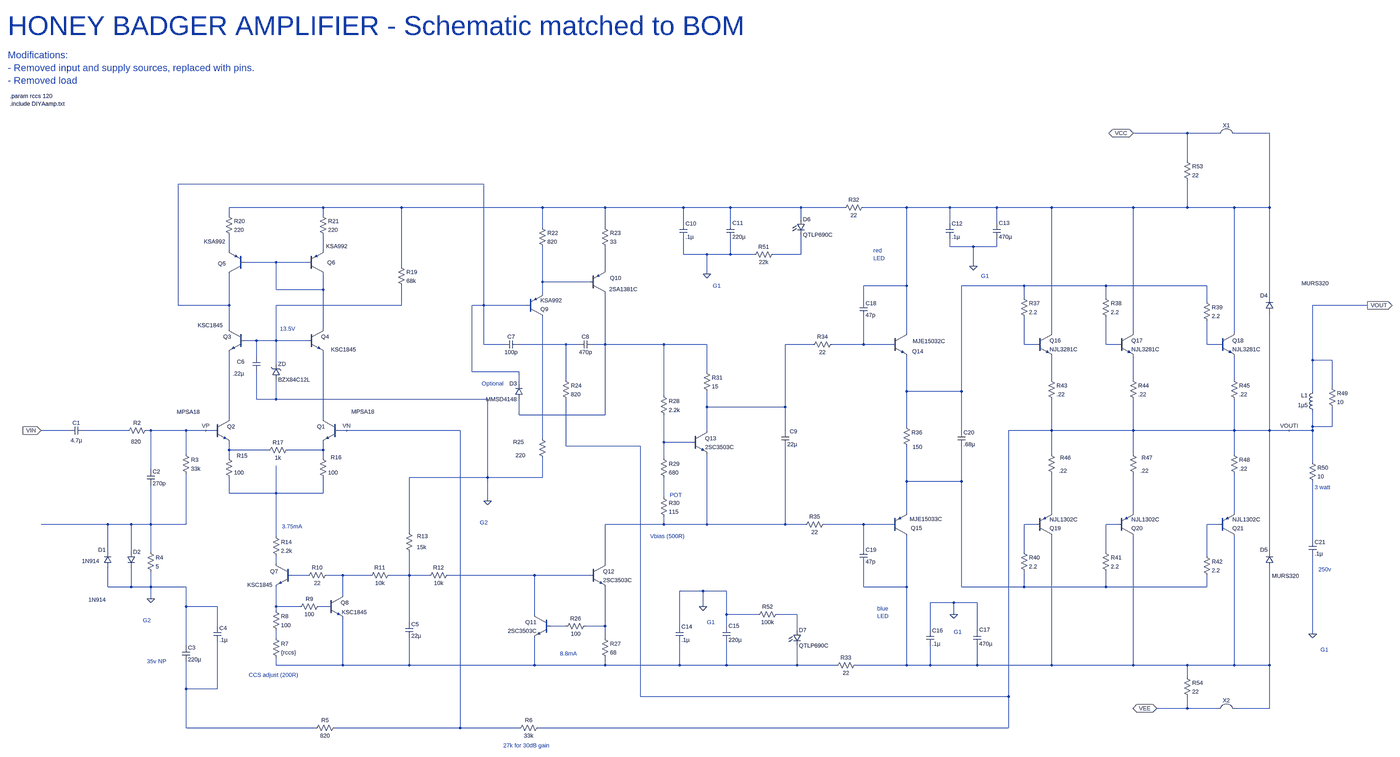
[diagram p0: schematic DIYA-amp-LT-2p4-BOM_SH.asc, whole sheet]
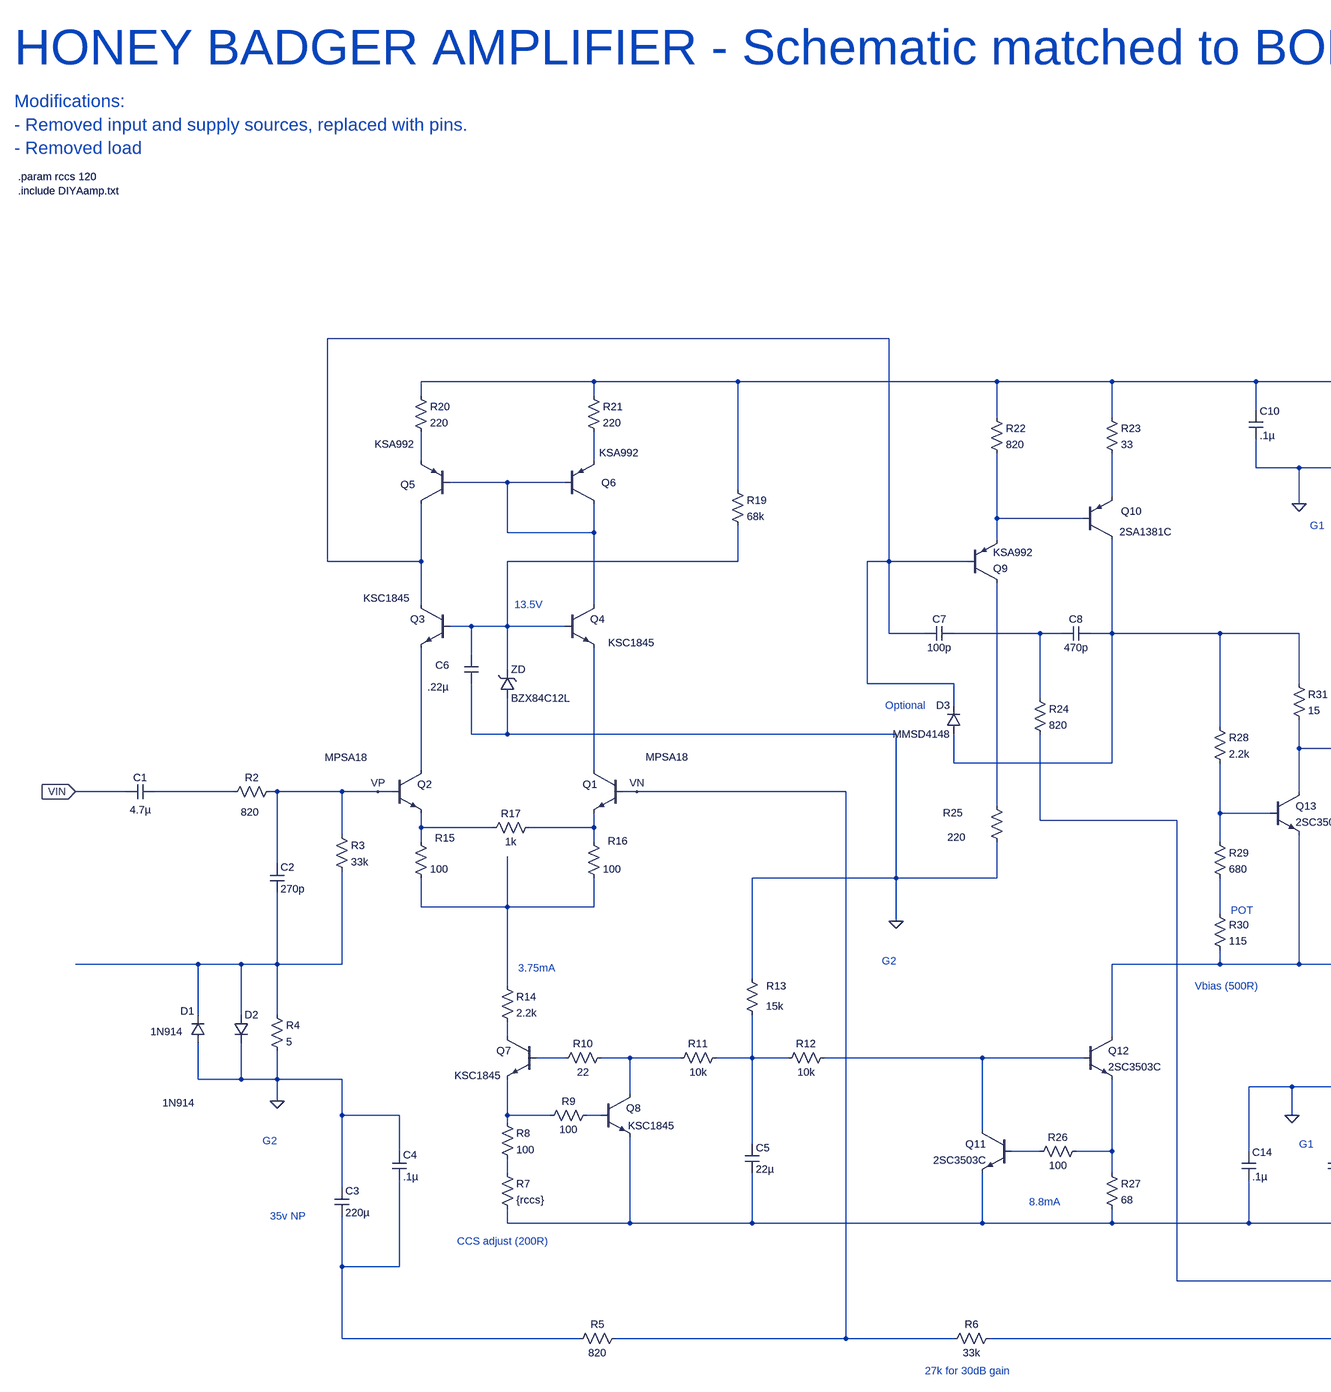
[diagram p1: schematic DIYA-amp-LT-2p4-BOM_SH.asc, part, row 1 of 1, column 1 of 2]
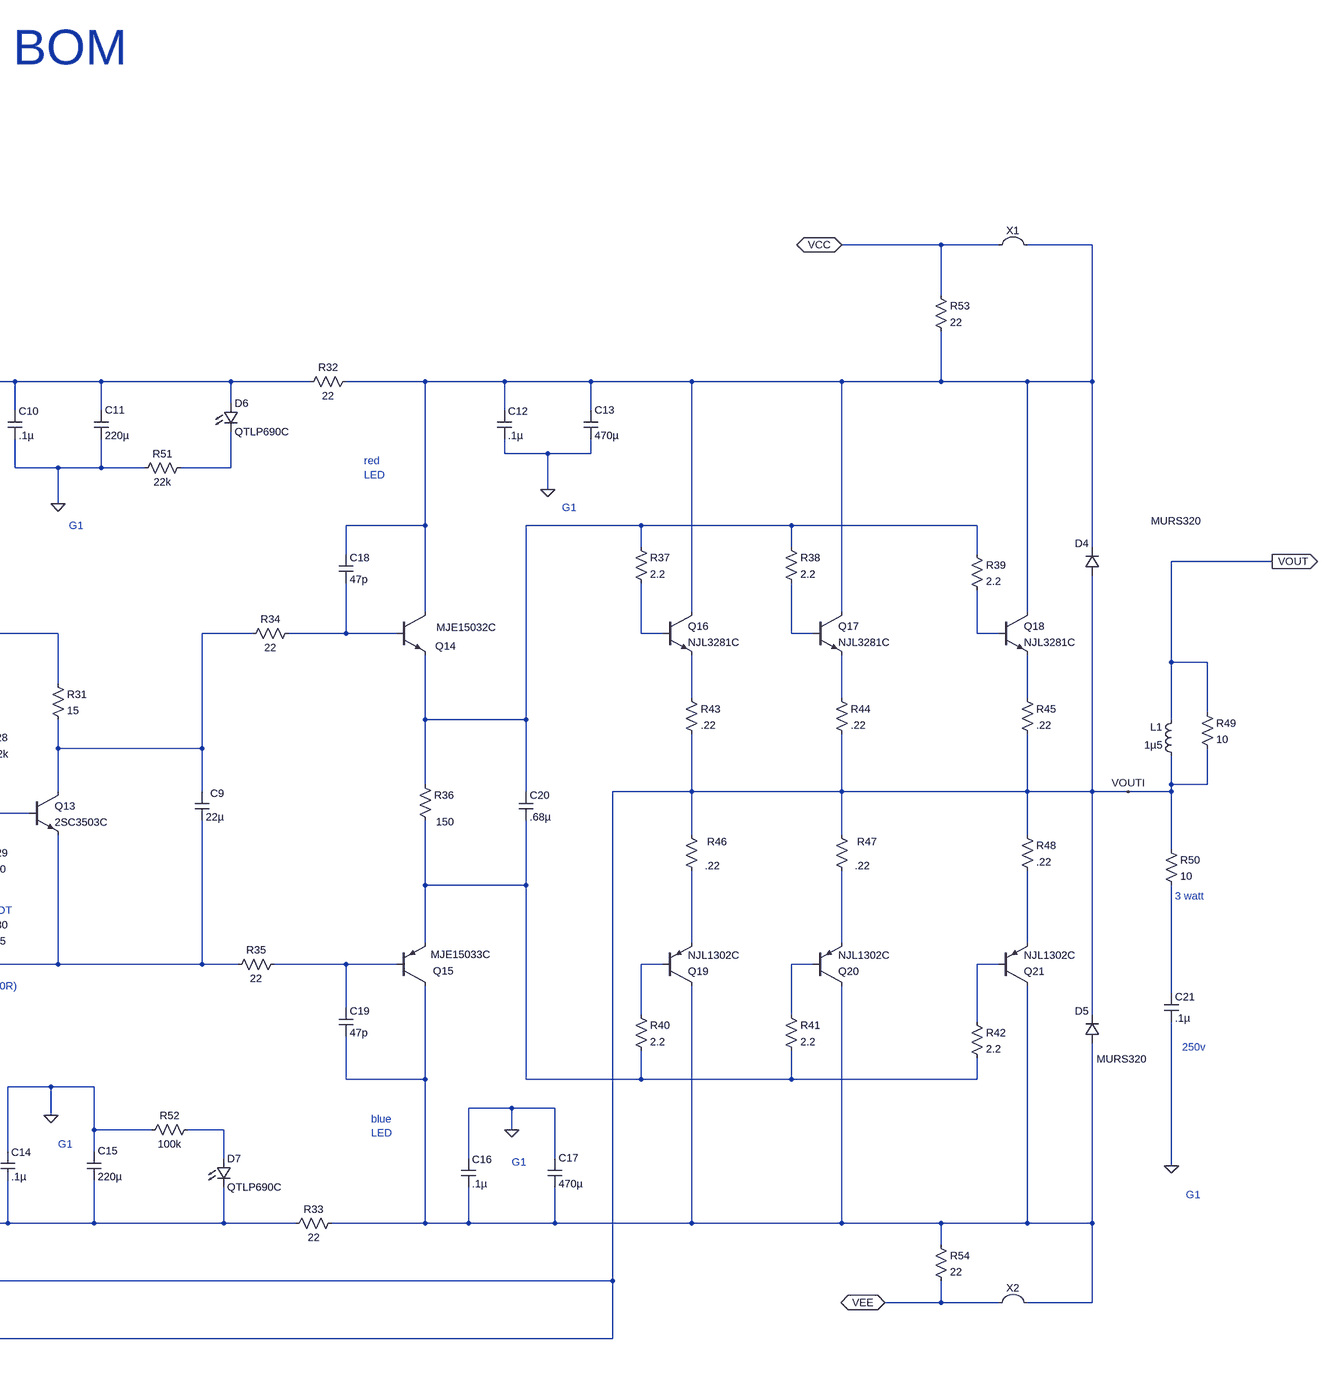
[diagram p2: schematic DIYA-amp-LT-2p4-BOM_SH.asc, part, row 1 of 1, column 2 of 2]
DIYA-amp-LT-2p4-BOM_SH.asc, the LTspice schematic file:
Version 4
SHEET 1 5148 21624
WIRE 3568 -512 3344 -512
WIRE 3696 -512 3568 -512
WIRE 3904 -512 3760 -512
WIRE 3568 -400 3568 -512
WIRE 592 -304 -656 -304
WIRE -64 -208 -448 -208
WIRE 256 -208 -64 -208
WIRE 832 -208 256 -208
WIRE 1088 -208 832 -208
WIRE 1408 -208 1088 -208
WIRE 1600 -208 1408 -208
WIRE 1888 -208 1600 -208
WIRE 2064 -208 1888 -208
WIRE 2320 -208 2144 -208
WIRE 2496 -208 2320 -208
WIRE 2688 -208 2496 -208
WIRE 2912 -208 2688 -208
WIRE 3344 -208 2912 -208
WIRE 3568 -208 3568 -320
WIRE 3568 -208 3344 -208
WIRE 3760 -208 3568 -208
WIRE 3904 -208 3904 -512
WIRE 3904 -208 3760 -208
WIRE -448 -176 -448 -208
WIRE -64 -176 -64 -208
WIRE 1888 -160 1888 -208
WIRE 1408 -144 1408 -208
WIRE 1600 -144 1600 -208
WIRE 2496 -144 2496 -208
WIRE 2688 -144 2688 -208
WIRE 832 -128 832 -208
WIRE 1088 -128 1088 -208
WIRE 2496 -48 2496 -80
WIRE 2592 -48 2496 -48
WIRE 2688 -48 2688 -80
WIRE 2688 -48 2592 -48
WIRE -448 -32 -448 -96
WIRE -64 -32 -64 -96
WIRE 1408 -16 1408 -80
WIRE 1504 -16 1408 -16
WIRE 1600 -16 1600 -80
WIRE 1600 -16 1504 -16
WIRE 1696 -16 1600 -16
WIRE 1888 -16 1888 -96
WIRE 1888 -16 1776 -16
WIRE -256 16 -384 16
WIRE -128 16 -256 16
WIRE 256 32 256 -208
WIRE 2592 32 2592 -48
WIRE 1088 48 1088 -48
WIRE 1504 64 1504 -16
WIRE 832 96 832 -48
WIRE 1024 96 832 96
WIRE 2320 112 2320 -208
WIRE 2320 112 2144 112
WIRE 2800 112 2544 112
WIRE 3232 112 2800 112
WIRE 3648 112 3232 112
WIRE -256 128 -256 16
WIRE -64 128 -64 64
WIRE -64 128 -256 128
WIRE 832 144 832 96
WIRE 2800 160 2800 112
WIRE 3232 160 3232 112
WIRE 3904 160 3904 -208
WIRE 2144 176 2144 112
WIRE 3648 176 3648 112
WIRE -656 192 -656 -304
WIRE -448 192 -448 64
WIRE -448 192 -656 192
WIRE 256 192 256 112
WIRE 256 192 -256 192
WIRE 592 192 592 -304
WIRE 592 192 544 192
WIRE 768 192 592 192
WIRE 4304 192 4080 192
WIRE -448 288 -448 192
WIRE -64 288 -64 128
WIRE 2320 304 2320 112
WIRE 2912 304 2912 -208
WIRE 3344 304 3344 -208
WIRE 3760 304 3760 -208
WIRE -336 336 -384 336
WIRE -256 336 -256 192
WIRE -256 336 -336 336
WIRE -128 336 -256 336
WIRE 592 352 592 192
WIRE 672 352 592 352
WIRE 928 352 736 352
WIRE 976 352 928 352
WIRE 1088 352 1088 144
WIRE 1088 352 1040 352
WIRE 1328 352 1088 352
WIRE 1504 352 1328 352
WIRE 1936 352 1824 352
WIRE 2144 352 2144 240
WIRE 2144 352 2016 352
WIRE 2256 352 2144 352
WIRE 2800 352 2800 240
WIRE 2848 352 2800 352
WIRE 3232 352 3232 240
WIRE 3280 352 3232 352
WIRE 3648 352 3648 256
WIRE 3696 352 3648 352
WIRE -336 400 -336 336
WIRE 4080 416 4080 192
WIRE 4160 416 4080 416
WIRE -256 432 -256 336
WIRE 544 464 544 192
WIRE 736 464 544 464
WIRE 1504 464 1504 352
WIRE 928 496 928 352
WIRE 2912 496 2912 400
WIRE 3344 496 3344 400
WIRE 3760 496 3760 400
WIRE 736 512 736 464
WIRE 4160 528 4160 416
WIRE 2320 544 2320 400
WIRE 2544 544 2544 112
WIRE 2544 544 2320 544
WIRE 4080 544 4080 416
WIRE 1328 560 1328 352
WIRE -336 576 -336 464
WIRE -256 576 -256 496
WIRE -256 576 -336 576
WIRE 608 576 -256 576
WIRE 1504 608 1504 544
WIRE 1824 608 1824 352
WIRE 1824 608 1504 608
WIRE 736 640 736 576
WIRE 1088 640 1088 352
WIRE 1088 640 736 640
WIRE -448 656 -448 384
WIRE -64 656 -64 384
WIRE 2320 688 2320 544
WIRE 4080 688 4080 624
WIRE 4160 688 4160 608
WIRE 4160 688 4080 688
WIRE -1104 704 -1216 704
WIRE -864 704 -1040 704
WIRE -768 704 -784 704
WIRE -624 704 -768 704
WIRE -544 704 -624 704
WIRE -512 704 -544 704
WIRE 32 704 0 704
WIRE 496 704 32 704
WIRE 1504 704 1504 608
WIRE 1824 704 1824 608
WIRE 2544 704 2544 544
WIRE 2912 704 2912 576
WIRE 2912 704 2736 704
WIRE 3344 704 3344 576
WIRE 3344 704 2912 704
WIRE 3760 704 3760 576
WIRE 3760 704 3344 704
WIRE 3904 704 3904 224
WIRE 3904 704 3760 704
WIRE 3984 704 3904 704
WIRE 4080 704 4080 688
WIRE 4080 704 3984 704
WIRE 832 736 832 240
WIRE 1328 752 1328 640
WIRE 1440 752 1328 752
WIRE 928 768 928 576
WIRE 1232 768 928 768
WIRE -448 784 -448 752
WIRE -288 784 -448 784
WIRE -64 784 -64 752
WIRE -64 784 -208 784
WIRE -624 800 -624 704
WIRE 2912 800 2912 704
WIRE 3344 800 3344 704
WIRE 3760 800 3760 704
WIRE -448 816 -448 784
WIRE -64 816 -64 784
WIRE 1328 816 1328 752
WIRE 4080 832 4080 704
WIRE -768 864 -768 704
WIRE 608 896 608 576
WIRE 608 896 288 896
WIRE 832 896 832 816
WIRE 832 896 608 896
WIRE 2320 912 2320 768
WIRE 2544 912 2544 768
WIRE 2544 912 2320 912
WIRE -448 960 -448 896
WIRE -256 960 -256 848
WIRE -256 960 -448 960
WIRE -64 960 -64 896
WIRE -64 960 -256 960
WIRE 1328 976 1328 896
WIRE 608 992 608 896
WIRE 2320 1040 2320 912
WIRE 2912 1040 2912 880
WIRE 3344 1040 3344 880
WIRE 3760 1040 3760 880
WIRE -944 1088 -1216 1088
WIRE -848 1088 -944 1088
WIRE -768 1088 -768 928
WIRE -768 1088 -848 1088
WIRE -624 1088 -624 880
WIRE -624 1088 -768 1088
WIRE 1328 1088 1328 1056
WIRE 1328 1088 1088 1088
WIRE 1504 1088 1504 800
WIRE 1504 1088 1328 1088
WIRE 1824 1088 1824 768
WIRE 1824 1088 1504 1088
WIRE 1904 1088 1824 1088
WIRE 2144 1088 1984 1088
WIRE 2256 1088 2144 1088
WIRE 2848 1088 2800 1088
WIRE 3280 1088 3232 1088
WIRE 3696 1088 3648 1088
WIRE 288 1120 288 896
WIRE -256 1136 -256 960
WIRE 4080 1152 4080 912
WIRE 2144 1184 2144 1088
WIRE -944 1200 -944 1088
WIRE -848 1200 -848 1088
WIRE -768 1200 -768 1088
WIRE 2800 1200 2800 1088
WIRE 3232 1200 3232 1088
WIRE 3904 1200 3904 704
WIRE 3648 1216 3648 1088
WIRE -256 1248 -256 1216
WIRE 1088 1248 1088 1088
WIRE -128 1296 -192 1296
WIRE 16 1296 -48 1296
WIRE 128 1296 16 1296
WIRE 288 1296 288 1200
WIRE 288 1296 208 1296
WIRE 368 1296 288 1296
WIRE 800 1296 448 1296
WIRE 1024 1296 800 1296
WIRE -944 1344 -944 1264
WIRE -848 1344 -848 1264
WIRE -848 1344 -944 1344
WIRE -768 1344 -768 1280
WIRE -768 1344 -848 1344
WIRE -624 1344 -768 1344
WIRE 2144 1344 2144 1248
WIRE 2320 1344 2320 1136
WIRE 2320 1344 2144 1344
WIRE 2544 1344 2544 912
WIRE 2800 1344 2800 1280
WIRE 2800 1344 2544 1344
WIRE 3232 1344 3232 1280
WIRE 3232 1344 2800 1344
WIRE 3648 1344 3648 1296
WIRE 3648 1344 3232 1344
WIRE 1488 1360 1392 1360
WIRE 1584 1360 1488 1360
WIRE 16 1376 16 1296
WIRE -768 1392 -768 1344
WIRE 2512 1408 2416 1408
WIRE 2608 1408 2512 1408
WIRE -624 1424 -624 1344
WIRE -496 1424 -624 1424
WIRE -256 1424 -256 1344
WIRE -160 1424 -256 1424
WIRE -48 1424 -80 1424
WIRE 1488 1424 1488 1360
WIRE -256 1440 -256 1424
WIRE 800 1456 800 1296
WIRE 1584 1456 1584 1360
WIRE 1712 1456 1584 1456
WIRE 1872 1456 1792 1456
WIRE 2512 1456 2512 1408
WIRE 288 1488 288 1296
WIRE -496 1504 -496 1424
WIRE 928 1504 864 1504
WIRE 1088 1504 1088 1344
WIRE 1088 1504 1008 1504
WIRE 1392 1504 1392 1360
WIRE 1584 1504 1584 1456
WIRE 1872 1520 1872 1456
WIRE 2416 1520 2416 1408
WIRE 2608 1520 2608 1408
WIRE 4080 1536 4080 1216
WIRE -256 1552 -256 1520
WIRE 1088 1552 1088 1504
WIRE -624 1584 -624 1424
WIRE -256 1664 -256 1632
WIRE 16 1664 16 1472
WIRE 16 1664 -256 1664
WIRE 288 1664 288 1552
WIRE 288 1664 16 1664
WIRE 800 1664 800 1552
WIRE 800 1664 288 1664
WIRE 1088 1664 1088 1632
WIRE 1088 1664 800 1664
WIRE 1392 1664 1392 1568
WIRE 1392 1664 1088 1664
WIRE 1584 1664 1584 1568
WIRE 1584 1664 1392 1664
WIRE 1872 1664 1872 1584
WIRE 1872 1664 1584 1664
WIRE 2032 1664 1872 1664
WIRE 2320 1664 2320 1344
WIRE 2320 1664 2112 1664
WIRE 2416 1664 2416 1584
WIRE 2416 1664 2320 1664
WIRE 2608 1664 2608 1584
WIRE 2608 1664 2416 1664
WIRE 2912 1664 2912 1136
WIRE 2912 1664 2608 1664
WIRE 3344 1664 3344 1136
WIRE 3344 1664 2912 1664
WIRE 3568 1664 3344 1664
WIRE 3760 1664 3760 1136
WIRE 3760 1664 3568 1664
WIRE 3904 1664 3904 1264
WIRE 3904 1664 3760 1664
WIRE 3568 1712 3568 1664
WIRE -624 1760 -624 1648
WIRE -496 1760 -496 1568
WIRE -496 1760 -624 1760
WIRE 1232 1792 1232 768
WIRE 2736 1792 2736 704
WIRE 2736 1792 1232 1792
WIRE 3568 1840 3568 1792
WIRE 3568 1840 3440 1840
WIRE 3696 1840 3568 1840
WIRE 3904 1840 3904 1664
WIRE 3904 1840 3760 1840
WIRE -624 1920 -624 1760
WIRE -96 1920 -624 1920
WIRE 496 1920 496 704
WIRE 496 1920 -16 1920
WIRE 736 1920 496 1920
WIRE 2736 1920 2736 1792
WIRE 2736 1920 816 1920
FLAG -768 1392 0
FLAG 2592 32 0
FLAG 4080 1536 0
FLAG 608 992 0
FLAG 2512 1456 0
FLAG 1504 64 0
FLAG 1488 1424 0
FLAG -1216 704 VIN
IOPIN -1216 704 In
FLAG 3344 -512 VCC
IOPIN 3344 -512 BiDir
FLAG 3440 1840 VEE
IOPIN 3440 1840 BiDir
FLAG 4304 192 VOUT
IOPIN 4304 192 Out
FLAG -544 704 VP
FLAG 32 704 VN
FLAG 3984 704 VOUTI
SYMBOL res -80 -192 R0
SYMATTR InstName R21
SYMATTR Value 220
SYMBOL res -464 -192 R0
SYMATTR InstName R20
SYMATTR Value 220
SYMBOL res -80 800 R0
WINDOW 0 47 14 Left 2
SYMATTR InstName R16
SYMATTR Value 100
SYMBOL res -464 800 R0
WINDOW 0 47 7 Left 2
SYMATTR InstName R15
SYMATTR Value 100
SYMBOL res -272 1120 R0
SYMATTR InstName R14
SYMATTR Value 2.2k
SYMBOL res -272 1536 R0
SYMATTR InstName R7
SYMATTR Value {rccs}
SYMBOL res -640 784 R0
SYMATTR InstName R3
SYMATTR Value 33k
SYMBOL res -768 688 R90
WINDOW 0 0 56 VBottom 2
WINDOW 3 46 60 VTop 2
SYMATTR InstName R2
SYMATTR Value 820
SYMBOL pnp 1024 144 M180
WINDOW 3 81 18 Left 2
WINDOW 0 84 64 Left 2
SYMATTR Value 2SA1381C
SYMATTR InstName Q10
SYMBOL npn 1024 1248 R0
SYMATTR InstName Q12
SYMATTR Value 2SC3503C
SYMBOL npn 2256 304 R0
WINDOW 0 86 76 Left 2
WINDOW 3 89 35 Left 2
SYMATTR InstName Q14
SYMATTR Value MJE15032C
SYMBOL res 3744 480 R0
SYMATTR InstName R45
SYMATTR Value .22
SYMBOL res 3744 784 R0
SYMATTR InstName R48
SYMATTR Value .22
SYMBOL res 4064 816 R0
SYMATTR InstName R50
SYMATTR Value 10
SYMBOL pnp 2256 1136 M180
WINDOW 0 81 33 Left 2
WINDOW 3 76 70 Left 2
SYMATTR InstName Q15
SYMATTR Value MJE15033C
SYMBOL res -784 1184 R0
SYMATTR InstName R4
SYMATTR Value 5
SYMBOL npn -192 1248 M0
WINDOW 3 79 87 Left 2
SYMATTR Value KSC1845
SYMATTR InstName Q7
SYMBOL npn -48 1376 R0
WINDOW 3 60 71 Left 2
SYMATTR Value KSC1845
SYMATTR InstName Q8
SYMBOL res 3632 160 R0
SYMATTR InstName R39
SYMATTR Value 2.2
SYMBOL res 3632 1200 R0
SYMATTR InstName R42
SYMATTR Value 2.2
SYMBOL ind 4096 640 R180
WINDOW 0 36 80 Left 2
WINDOW 3 36 40 Left 2
SYMATTR InstName L1
SYMATTR Value 1µ5
SYMBOL diode -864 1200 R0
WINDOW 3 -159 196 Left 2
SYMATTR Value 1N914
SYMATTR InstName D2
SYMBOL diode -928 1264 R180
WINDOW 0 24 72 Left 2
WINDOW 3 50 26 Left 2
SYMATTR InstName D1
SYMATTR Value 1N914
SYMBOL cap 4064 1152 R0
SYMATTR InstName C21
SYMATTR Value .1µ
SYMBOL res 4144 512 R0
SYMATTR InstName R49
SYMATTR Value 10
SYMBOL res 272 1104 R0
WINDOW 0 48 32 Left 2
WINDOW 3 47 77 Left 2
SYMATTR InstName R13
SYMATTR Value 15k
SYMBOL res -272 1424 R0
SYMATTR InstName R8
SYMATTR Value 100
SYMBOL cap -784 864 R0
SYMATTR InstName C2
SYMATTR Value 270p
SYMBOL res 832 1904 R90
WINDOW 3 32 56 VTop 2
WINDOW 0 0 56 VBottom 2
SYMATTR Value 33k
SYMATTR InstName R6
SYMBOL cap -640 1584 R0
SYMATTR InstName C3
SYMATTR Value 220µ
SYMBOL cap -1040 688 R90
WINDOW 0 0 32 VBottom 2
WINDOW 3 41 32 VTop 2
SYMATTR InstName C1
SYMATTR Value 4.7µ
SYMBOL cap -512 1504 R0
SYMATTR InstName C4
SYMATTR Value .1µ
SYMBOL pnp -384 64 R180
WINDOW 0 77 43 Left 2
WINDOW 3 79 133 Left 2
SYMATTR InstName Q5
SYMATTR Value KSA992
SYMBOL pnp -128 64 M180
WINDOW 0 81 47 Left 2
WINDOW 3 76 114 Left 2
SYMATTR InstName Q6
SYMATTR Value KSA992
SYMBOL res 1072 -144 R0
SYMATTR InstName R23
SYMATTR Value 33
SYMBOL npn 864 1456 M0
SYMATTR InstName Q11
SYMATTR Value 2SC3503C
SYMBOL pnp 768 240 M180
SYMATTR InstName Q9
SYMATTR Value KSA992
SYMBOL res 816 -144 R0
SYMATTR InstName R22
SYMATTR Value 820
SYMBOL res 1072 1536 R0
SYMATTR InstName R27
SYMATTR Value 68
SYMBOL res 816 720 R0
WINDOW 0 -104 31 Left 2
WINDOW 3 -94 85 Left 2
SYMATTR InstName R25
SYMATTR Value 220
SYMBOL res 224 1280 R90
WINDOW 0 0 56 VBottom 2
WINDOW 3 32 56 VTop 2
SYMATTR InstName R11
SYMATTR Value 10k
SYMBOL cap 272 1488 R0
SYMATTR InstName C5
SYMATTR Value 22µ
SYMBOL npn 3696 304 R0
SYMATTR InstName Q18
SYMATTR Value NJL3281C
SYMBOL pnp 3696 1136 M180
SYMATTR InstName Q21
SYMATTR Value NJL1302C
SYMBOL res 2896 480 R0
SYMATTR InstName R43
SYMATTR Value .22
SYMBOL res 2896 784 R0
WINDOW 0 50 31 Left 2
WINDOW 3 45 85 Left 2
SYMATTR InstName R46
SYMATTR Value .22
SYMBOL res 2784 144 R0
SYMATTR InstName R37
SYMATTR Value 2.2
SYMBOL res 2784 1184 R0
SYMATTR InstName R40
SYMATTR Value 2.2
SYMBOL npn 2848 304 R0
SYMATTR InstName Q16
SYMATTR Value NJL3281C
SYMBOL pnp 2848 1136 M180
SYMATTR InstName Q19
SYMATTR Value NJL1302C
SYMBOL res 464 1280 R90
WINDOW 0 0 56 VBottom 2
WINDOW 3 32 56 VTop 2
SYMATTR InstName R12
SYMATTR Value 10k
SYMBOL res -192 768 R90
WINDOW 0 0 56 VBottom 2
WINDOW 3 32 56 VTop 2
SYMATTR InstName R17
SYMATTR Value 1k
SYMBOL npn 1440 704 R0
SYMATTR InstName Q13
SYMATTR Value 2SC3503C
SYMBOL res 1312 960 R0
SYMATTR InstName R30
SYMATTR Value 115
SYMBOL res 1312 800 R0
SYMATTR InstName R29
SYMATTR Value 680
SYMBOL res 1312 544 R0
SYMATTR InstName R28
SYMATTR Value 2.2k
SYMBOL cap 1808 704 R0
WINDOW 0 34 4 Left 2
SYMATTR InstName C9
SYMATTR Value 22µ
SYMBOL diode 3920 224 R180
WINDOW 0 24 72 Left 2
WINDOW 3 -226 122 Left 2
SYMATTR InstName D4
SYMATTR Value MURS320
SYMBOL diode 3920 1264 R180
WINDOW 0 24 72 Left 2
WINDOW 3 -105 -35 Left 2
SYMATTR InstName D5
SYMATTR Value MURS320
SYMBOL cap 2480 -144 R0
WINDOW 0 24 2 Left 2
SYMATTR InstName C12
SYMATTR Value .1µ
SYMBOL cap 2672 -144 R0
WINDOW 0 24 -1 Left 2
SYMATTR InstName C13
SYMATTR Value 470µ
SYMBOL res 2304 672 R0
WINDOW 3 40 99 Left 2
SYMATTR Value 150
SYMATTR InstName R36
SYMBOL res 1024 1488 R90
WINDOW 0 0 56 VBottom 2
WINDOW 3 32 56 VTop 2
SYMATTR InstName R26
SYMATTR Value 100
SYMBOL cap 2528 704 R0
SYMATTR InstName C20
SYMATTR Value .68µ
SYMBOL cap 672 368 R270
WINDOW 0 32 32 VTop 2
WINDOW 3 0 32 VBottom 2
SYMATTR InstName C7
SYMATTR Value 100p
SYMBOL res -64 1408 R90
WINDOW 0 0 56 VBottom 2
WINDOW 3 32 56 VTop 2
SYMATTR InstName R9
SYMATTR Value 100
SYMBOL cap 2400 1520 R0
WINDOW 0 24 2 Left 2
SYMATTR InstName C16
SYMATTR Value .1µ
SYMBOL cap 2592 1520 R0
WINDOW 0 24 -1 Left 2
SYMATTR InstName C17
SYMATTR Value 470µ
SYMBOL res 2160 -224 R90
WINDOW 0 0 56 VBottom 2
WINDOW 3 32 56 VTop 2
SYMATTR InstName R32
SYMATTR Value 22
SYMBOL res 2128 1648 R90
WINDOW 0 0 56 VBottom 2
WINDOW 3 32 56 VTop 2
SYMATTR InstName R33
SYMATTR Value 22
SYMBOL cap 1392 -144 R0
WINDOW 0 24 2 Left 2
SYMATTR InstName C10
SYMATTR Value .1µ
SYMBOL cap 1584 -144 R0
WINDOW 0 24 -1 Left 2
SYMATTR InstName C11
SYMATTR Value 220µ
SYMBOL cap 1376 1504 R0
WINDOW 0 24 2 Left 2
SYMATTR InstName C14
SYMATTR Value .1µ
SYMBOL cap 1568 1504 R0
WINDOW 0 24 -1 Left 2
SYMATTR InstName C15
SYMATTR Value 220µ
SYMBOL res 1488 448 R0
SYMATTR InstName R31
SYMATTR Value 15
SYMBOL npn -128 288 R0
WINDOW 3 96 85 Left 2
SYMATTR Value KSC1845
SYMATTR InstName Q4
SYMBOL npn -384 288 M0
WINDOW 3 89 -14 Left 2
SYMATTR Value KSC1845
SYMATTR InstName Q3
SYMBOL res 240 16 R0
SYMATTR InstName R19
SYMATTR Value 68k
SYMBOL cap -352 400 R0
WINDOW 0 -64 23 Left 2
WINDOW 3 -82 71 Left 2
SYMATTR InstName C6
SYMATTR Value .22µ
SYMBOL npn 0 656 M0
WINDOW 3 -146 -29 Left 2
SYMATTR Value MPSA18
SYMATTR InstName Q1
SYMBOL npn -512 656 R0
WINDOW 3 -150 -28 Left 2
SYMATTR Value MPSA18
SYMATTR InstName Q2
SYMBOL res 2032 336 R90
WINDOW 0 0 56 VBottom 2
WINDOW 3 32 56 VTop 2
SYMATTR InstName R34
SYMATTR Value 22
SYMBOL res 2000 1072 R90
WINDOW 0 0 56 VBottom 2
WINDOW 3 32 56 VTop 2
SYMATTR InstName R35
SYMATTR Value 22
SYMBOL res -32 1280 R90
WINDOW 0 0 56 VBottom 2
WINDOW 3 32 56 VTop 2
SYMATTR InstName R10
SYMATTR Value 22
SYMBOL LED 1872 -160 R0
SYMATTR InstName D6
SYMATTR Value QTLP690C
SYMATTR Description Diode
SYMATTR Type diode
SYMBOL res 1792 -32 R90
WINDOW 0 0 56 VBottom 2
WINDOW 3 32 56 VTop 2
SYMATTR InstName R51
SYMATTR Value 22k
SYMBOL res 1808 1440 R90
WINDOW 0 0 56 VBottom 2
WINDOW 3 32 56 VTop 2
SYMATTR InstName R52
SYMATTR Value 100k
SYMBOL LED 1856 1520 R0
SYMATTR InstName D7
SYMATTR Value QTLP690C
SYMATTR Description Diode
SYMATTR Type diode
SYMBOL res 3328 480 R0
SYMATTR InstName R44
SYMATTR Value .22
SYMBOL res 3328 784 R0
WINDOW 0 50 31 Left 2
WINDOW 3 45 85 Left 2
SYMATTR InstName R47
SYMATTR Value .22
SYMBOL res 3216 144 R0
SYMATTR InstName R38
SYMATTR Value 2.2
SYMBOL res 3216 1184 R0
SYMATTR InstName R41
SYMATTR Value 2.2
SYMBOL npn 3280 304 R0
SYMATTR InstName Q17
SYMATTR Value NJL3281C
SYMBOL pnp 3280 1136 M180
SYMATTR InstName Q20
SYMATTR Value NJL1302C
SYMBOL Misc\\jumper 3728 -576 R0
SYMATTR InstName X1
SYMBOL Misc\\jumper 3728 1776 R0
SYMATTR InstName X2
SYMBOL res 3552 -416 R0
SYMATTR InstName R53
SYMATTR Value 22
SYMBOL res 3552 1696 R0
SYMATTR InstName R54
SYMATTR Value 22
SYMBOL zener -272 496 M180
WINDOW 0 24 64 Left 2
WINDOW 3 24 0 Left 2
SYMATTR InstName ZD
SYMATTR Value BZX84C12L
SYMATTR Description Diode
SYMATTR Type diode
SYMBOL res 912 480 R0
SYMATTR InstName R24
SYMATTR Value 820
SYMBOL cap 1040 336 R90
WINDOW 0 0 32 VBottom 2
WINDOW 3 32 32 VTop 2
SYMATTR InstName C8
SYMATTR Value 470p
SYMBOL res 0 1904 R90
WINDOW 0 0 56 VBottom 2
WINDOW 3 32 56 VTop 2
SYMATTR InstName R5
SYMATTR Value 820
SYMBOL diode 752 576 R180
WINDOW 0 24 64 Left 2
WINDOW 3 24 0 Left 2
SYMATTR InstName D3
SYMATTR Value MMSD4148
SYMBOL cap 2128 176 R0
SYMATTR InstName C18
SYMATTR Value 47p
SYMBOL cap 2128 1184 R0
SYMATTR InstName C19
SYMATTR Value 47p
TEXT -784 1648 Left 2 ;35v NP
TEXT 4088 936 Left 2 ;3 watt
TEXT 4104 1272 Left 2 ;250v
TEXT -232 1096 Left 2 ;3.75mA
TEXT -1344 -632 Left 2 !.include DIYAamp.txt
TEXT -1344 -664 Left 2 !.param rccs 120
TEXT 1272 1136 Left 2 ;Vbias (500R)
TEXT -368 1704 Left 2 ;CCS adjust (200R)
TEXT -800 1480 Left 2 ;G2
TEXT 576 1080 Left 2 ;G2
TEXT 4112 1600 Left 2 ;G1
TEXT 904 1616 Left 2 ;8.8mA
TEXT -240 288 Left 2 ;13.5V
TEXT 2200 1432 Left 2 ;blue\nLED
TEXT 2184 -32 Left 2 ;red\nLED
TEXT 1528 112 Left 2 ;G1
TEXT 2624 72 Left 2 ;G1
TEXT 2512 1528 Left 2 ;G1
TEXT 1504 1488 Left 2 ;G1
TEXT 584 512 Left 2 ;Optional
TEXT 672 1992 Left 2 ;27k for 30dB gain
TEXT 1352 968 Left 2 ;POT
TEXT -1352 -952 Left 7 ;HONEY BADGER AMPLIFIER - Schematic matched to BOM
TEXT -1352 -832 Left 4 ;Modifications: \n- Removed input and supply sources, replaced with pins.\n- Removed load

The netlist it stands for:
* DIYA-amp-LT-2p4-BOM_SH.asc
R21 N002 N004 220
R20 N002 N003 220
R16 N027 N029 100
R15 N026 N029 100
R14 N029 N041 2.2k
R7 N051 N052 {rccs}
R3 VP N034 33k
R2 VP N023 820
Q10 N012 N008 N007 0 2SA1381C
Q12 N035 N045 N050 0 2SC3503C
Q14 VCC N014 N009 0 MJE15032C
R45 N020 VOUTI .22
R48 VOUTI N033 .22
R50 VOUTI N040 10
Q15 VEE N036 N028 0 MJE15033C
R4 N034 0 5
Q7 N041 N042 N046 0 KSC1845
Q8 N043 N047 N052 0 KSC1845
R39 N009 N017 2.2
R42 N039 N028 2.2
L1 VOUTI VOUT 1µ5
D2 N034 0 1N914
D1 0 N034 1N914
C21 N040 0 .1µ
R49 VOUT VOUTI 10
R13 0 N044 15k
R8 N046 N051 100
C2 VP N034 270p
R6 VOUTI VN 33k
C3 0 N053 220µ
C1 N023 VIN 4.7µ
C4 0 N053 .1µ
Q5 N001 N006 N003 0 KSA992
Q6 N006 N006 N004 0 KSA992
R23 N002 N007 33
Q11 N045 N049 N052 0 2SC3503C
Q9 N024 N001 N008 0 KSA992
R22 N002 N008 820
R27 N050 N052 68
R25 N024 0 220
R11 N044 N043 10k
C5 N044 N052 22µ
Q18 VCC N017 N020 0 NJL3281C
Q21 VEE N039 N033 0 NJL1302C
R43 N018 VOUTI .22
R46 VOUTI N031 .22
R37 N009 N015 2.2
R40 N037 N028 2.2
Q16 VCC N015 N018 0 NJL3281C
Q19 VEE N037 N031 0 NJL1302C
R12 N045 N044 10k
R17 N027 N026 1k
Q13 N013 N025 N035 0 2SC3503C
R30 N030 N035 115
R29 N025 N030 680
R28 N012 N025 2.2k
C9 N013 N035 22µ
D4 VOUTI VCC MURS320
D5 VEE VOUTI MURS320
C12 VCC 0 .1µ
C13 VCC 0 470µ
R36 N009 N028 150
R26 N050 N049 100
C20 N009 N028 .68µ
C7 N001 N011 100p
R9 N047 N046 100
C16 0 VEE .1µ
C17 0 VEE 470µ
R32 VCC N002 22
R33 VEE N052 22
C10 N002 0 .1µ
C11 N002 0 220µ
C14 0 N052 .1µ
C15 0 N052 220µ
R31 N012 N013 15
Q4 N006 N010 N022 0 KSC1845
Q3 N001 N010 N021 0 KSC1845
R19 N002 N010 68k
C6 N010 0 .22µ
Q1 N022 VN N027 0 MPSA18
Q2 N021 VP N026 0 MPSA18
R34 N014 N013 22
R35 N036 N035 22
R10 N043 N042 22
D6 N002 N005 QTLP690C
R51 N005 0 22k
R52 N048 0 100k
D7 N048 N052 QTLP690C
R44 N019 VOUTI .22
R47 VOUTI N032 .22
R38 N009 N016 2.2
R41 N038 N028 2.2
Q17 VCC N016 N019 0 NJL3281C
Q20 VEE N038 N032 0 NJL1302C
R53 VCC VCC 22
R54 VEE VEE 22
D§ZD 0 N010 BZX84C12L
R24 N011 VOUTI 820
C8 N012 N011 470p
R5 VN N053 820
D3 N012 N001 MMSD4148
C18 VCC N014 47p
C19 N036 VEE 47p
.model D D
.lib standard.dio
.model NPN NPN
.model PNP PNP
.lib standard.bjt
* 35v NP
* 3 watt
* 250v
* 3.75mA
.include DIYAamp.txt
.param rccs 120
* Vbias (500R)
* CCS adjust (200R)
* G2
* G2
* G1
* 8.8mA
* 13.5V
* blue
* LED
* red
* LED
* G1
* G1
* G1
* G1
* Optional
* 27k for 30dB gain
* POT
* HONEY BADGER AMPLIFIER - Schematic matched to BOM
* Modifications:
* - Removed input and supply sources, replaced with pins.
* - Removed load
.backanno
.end